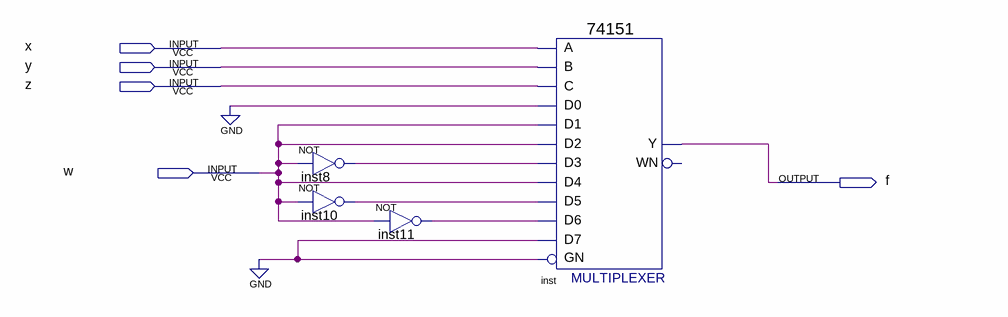
[diagram p0: schematic sheet]
// Quartus schematic lab06.bdf as structural Verilog: 4 symbols, 5 pins
module lab06 (
  input  x,
  input  y,
  input  z,
  input  w,
  output f
);

  wire inst8_out, inst10_out, inst11_out;

  not inst8 (inst8_out, w);
  not inst10 (inst10_out, w);
  not inst11 (inst11_out, w);
  \74151  inst (
    .GN(1'b0), .C(z), .B(y), .A(x), .D5(inst10_out), .D0(1'b0), .D1(w), .D4(w), .D3(inst8_out), .D2(w),
    .D6(inst11_out), .D7(1'b0), .Y(f));  // open: WN
endmodule
